# Altium schematic sheet Gecko3Power.SCHDOC: Power Supply Board/ Robot Chassis
size A4; ApprovedBy: zac1; Author: mmb1; DrawnBy: mmb1; Engineer: mmb1; Organization: Berne University of Applied Sciences; Address1: School of Engineering and; Address2: Information Technology; Address3: Quellgasse 21; Address4: CH-2501 Biel; Revision: 1.0; SheetNumber: 1; SheetTotal: 6
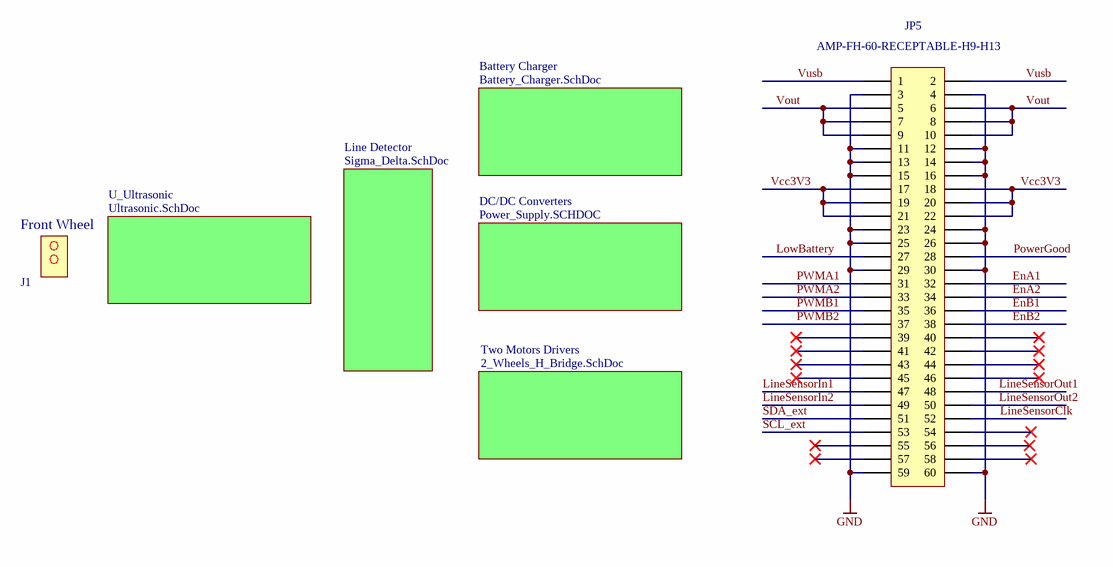
[diagram p0: Gecko3Power.SCHDOC]

## Parts
?  CC License  [CC-License]  (value not drawn)
J1  fi  [Roue]  (value not drawn)
JP5  AMP-FH-60-RECEPTABLE-H9-H13  [amp_FH_.8mm_60pin_r_H9_H13]

## Sub-sheets
Battery Charger = Battery_Charger.SchDoc: no entries
DC/DC Converters = Power_Supply.SCHDOC: no entries
Line Detector = Sigma_Delta.SchDoc: no entries
Two Motors Drivers = 2_Wheels_H_Bridge.SchDoc: no entries
U_Ultrasonic = Ultrasonic.SchDoc: no entries

## Nets
GND: JP5.3 JP5.4 JP5.11 JP5.12 JP5.13 JP5.14 JP5.15 JP5.16 JP5.23 JP5.24 JP5.25 JP5.26 JP5.29 JP5.30 JP5.59 JP5.60
EnA1: JP5.32
EnA2: JP5.34
EnB1: JP5.36
EnB2: JP5.38
LineSensorClk: JP5.52
LineSensorIn1: JP5.47
LineSensorIn2: JP5.49
LineSensorOut1: JP5.48
LineSensorOut2: JP5.50
LowBattery: JP5.27
PowerGood: JP5.28
PWMA1: JP5.31
PWMA2: JP5.33
PWMB1: JP5.35
PWMB2: JP5.37
SCL_ext: JP5.53
SDA_ext: JP5.51
Vcc3V3: JP5.17 JP5.18 JP5.19 JP5.20 JP5.21 JP5.22
Vout: JP5.5 JP5.6 JP5.7 JP5.8 JP5.9 JP5.10
Vusb: JP5.1 JP5.2

Not connected (* = marked no-connect by the designer): JP5 39* 40* 41* 42* 43* 44* 45* 46* 54* 55* 56* 57* 58*

## Notes on the sheet
- Title:
- Size:
- Date:
- A4_L
- Author:
- Time:
- Revision:
- Sheet
- of
- File:
- (in symbol ROUE) Front Wheel

## Library data of the parts
J1 = ROUE
JP5 = AMP-FH-60-RECEPTABLE-H9-H13: AMP Free Height System, 0.8mm, 60 Pin, 9 or 13mm Height, Receptable; Part Number: 5-5179010-2; Value: fh-60r-13mm; Currency: CHF; Packaging unit: 1; Distributor: Farnell; Distributor Number: 1098 357; Manufacturer: AMP; RoHS: yes; Price: 3.85